# Altium project Circadian2 Proto.PrjPcb
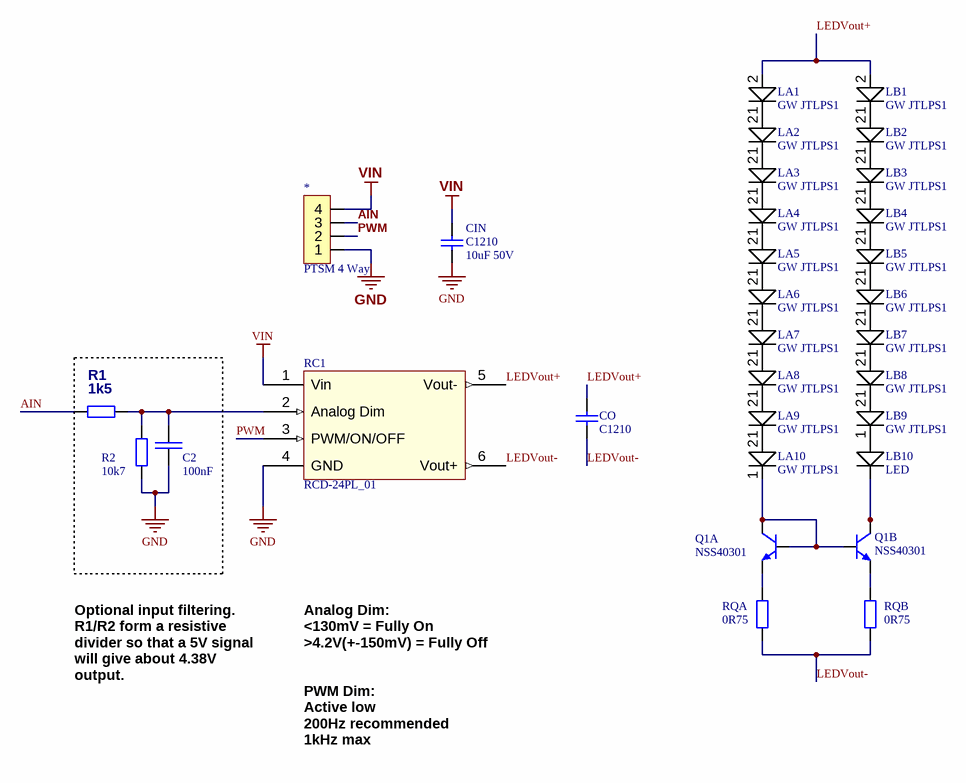
[diagram p0: Circadian2.SchDoc]
1 sheet, 30 parts. Net scope: global (net labels, ports and power ports of the same name join across sheets).
Board file: Circadian2-V2.PcbDoc

## Sheet Circadian2.SchDoc
size A4

### Parts
*  PTSM 4 Way  [PTSM - 4 Way Vertical]
C2  100nF  [CAP_SM0603_YAGEOCC2_N]
CIN  C1210  value 10uF 50V  [1210]
CO  C1210  [1210]
LA1  GW JTLPS1  [E2835]
LA2  GW JTLPS1  [E2835]
LA3  GW JTLPS1  [E2835]
LA4  GW JTLPS1  [E2835]
LA5  GW JTLPS1  [E2835]
LA6  GW JTLPS1  [E2835]
LA7  GW JTLPS1  [E2835]
LA8  GW JTLPS1  [E2835]
LA9  GW JTLPS1  [E2835]
LA10  GW JTLPS1  [E2835]
LB1  GW JTLPS1  [E2835]
LB2  GW JTLPS1  [E2835]
LB3  GW JTLPS1  [E2835]
LB4  GW JTLPS1  [E2835]
LB5  GW JTLPS1  [E2835]
LB6  GW JTLPS1  [E2835]
LB7  GW JTLPS1  [E2835]
LB8  GW JTLPS1  [E2835]
LB9  GW JTLPS1  [E2835]
LB10  LED  [E2835]
Q1  NSS40301  [SOIC8]  (parts A,B of 2)
R1  1k5  [RES_SM0603_YAGEORC_N]
R2  10k7  [RES_SM0603_YAGEORC_N]
RC1  RCD-24PL_01  [RCD-24PL_01]
RQA  0R75  [RES_SM0603_YAGEORC_N]
RQB  0R75  [RES_SM0603_YAGEORC_N]

### Nets
GND: *.1 C2.2 CIN.2 R2.1 RC1.4(GND)
VIN: *.4 CIN.1 RC1.1(Vin)
AIN: *.3 R1.2
LEDVout+: CO.1 LA1.2(A) LB1.2(A) RC1.5(Vout-)
LEDVout-: CO.2 RC1.6(Vout+) RQA.1 RQB.1
PWM: *.2 RC1.3(PWM/ON/OFF)
NetC2_1: C2.1 R1.1 R2.2 RC1.2(Analog_Dim)
NetLA1_1: LA1.1(K) LA2.2(A)
NetLA2_1: LA2.1(K) LA3.2(A)
NetLA3_1: LA3.1(K) LA4.2(A)
NetLA4_1: LA4.1(K) LA5.2(A)
NetLA5_1: LA5.1(K) LA6.2(A)
NetLA6_1: LA6.1(K) LA7.2(A)
NetLA7_1: LA7.1(K) LA8.2(A)
NetLA8_1: LA8.1(K) LA9.2(A)
NetLA9_1: LA9.1(K) LA10.2(A)
NetLA10_1: LA10.1(K) Q1.2(B1) Q1.4(B2) Q1.7(C1) Q1.8(C1)
NetLB1_1: LB1.1(K) LB2.2(A)
NetLB2_1: LB2.1(K) LB3.2(A)
NetLB3_1: LB3.1(K) LB4.2(A)
NetLB4_1: LB4.1(K) LB5.2(A)
NetLB5_1: LB5.1(K) LB6.2(A)
NetLB6_1: LB6.1(K) LB7.2(A)
NetLB7_1: LB7.1(K) LB8.2(A)
NetLB8_1: LB8.1(K) LB9.2(A)
NetLB9_1: LB9.1(K) LB10.2(A)
NetLB10_1: LB10.1(K) Q1.5(C2) Q1.6(C2)
NetQ1_1: Q1.1(E1) RQA.2
NetQ1_3: Q1.3(E2) RQB.2

### Notes on the sheet
- Optional input filtering.
  R1/R2 form a resistive divider so that a 5V signal will give about 4.38V output.
- Analog Dim:
  <130mV = Fully On
  >4.2V(+-150mV) = Fully Off
- PWM Dim:
  Active low
  200Hz recommended
  1kHz max

### Library data of the parts
C2 = CC0603KRX7R9BB104: CAP 100nF SM0603 X7R 50V YAGEO CC2; Tolerance (%): 10; Voltage Rating (Volts): 50; Category: Capacitor; Manufacturer: Yageo; Manufacturer Part Number: CC0603KRX7R9BB104; Package: 0603; Value: 100nF; Supplier Part Number 1: 1362556; Supplier 1: Farnell; ComponentLink1URL: http://www.yageo.com; ComponentLink1Description: Manufacturer Website; Supplier 2: Digi-Key; Supplier Part Number 2: 311-1344-1-ND
CIN = C1210: Ceramic Chip Capacitor - Standard; Published: 17-Jul-2002; LatestRevisionDate: 19-Mar-2004; LatestRevisionNote: Silkscreen size reduced.; DatasheetDocument: Mar-2001; PackageDocument: Mar-2001; PackageReference: 1210; Publisher: Altium Limited; Code_JEITA: 1210; Code_IPC: 3225 [1210]; ComponentLink1Description: Manufacturer Link; ComponentLink1URL: http://www.kemet.com/; ComponentLink2Description: Datasheet; ComponentLink2URL: http://www.kemet.com/kemet/web/homepage/kechome.nsf/vapubfilesname/F3102TA.pdf/$file/F3102TA.pdf
CO = C1210: Ceramic Chip Capacitor - Standard; Value: 100pF; Published: 17-Jul-2002; LatestRevisionDate: 19-Mar-2004; LatestRevisionNote: Silkscreen size reduced.; DatasheetDocument: Mar-2001; PackageDocument: Mar-2001; PackageReference: 1210; Publisher: Altium Limited; Code_JEITA: 1210; Code_IPC: 3225 [1210]; ComponentLink1Description: Manufacturer Link; ComponentLink1URL: http://www.kemet.com/; ComponentLink2Description: Datasheet; ComponentLink2URL: http://www.kemet.com/kemet/web/homepage/kechome.nsf/vapubfilesname/F3102TA.pdf/$file/F3102TA.pdf
LA1-LA10 LB1-LB9 = GW JTLPS1.CM LED: Osram LED
LB10 = LED: Osram LED
R1 R2 RQA RQB = RC0603FR-0710RL: RES 10R SM0603 YAGEO RC_L; Power (Watts): 0.1; Resistance (Ohms): 10; Tolerance (%): 1; Category: Resistor; Manufacturer: Yageo; Manufacturer Part Number: RC0603FR-0710RL; Package: 0603; Supplier Part Number 1: 9238247; Supplier 1: Farnell; ComponentLink1URL: http://www.yageo.com; ComponentLink1Description: Manufacturer Website; Supplier 2: Digi-Key; Supplier Part Number 2: 311-10.0HRCT-ND
  R1: Value: 1k5
  R2: Value: 10k7
  RQA RQB: Value: 0R75